# EAGLE design USB2MCV REV1 (EAGLE 6.1)

## Sheet 1 of 4
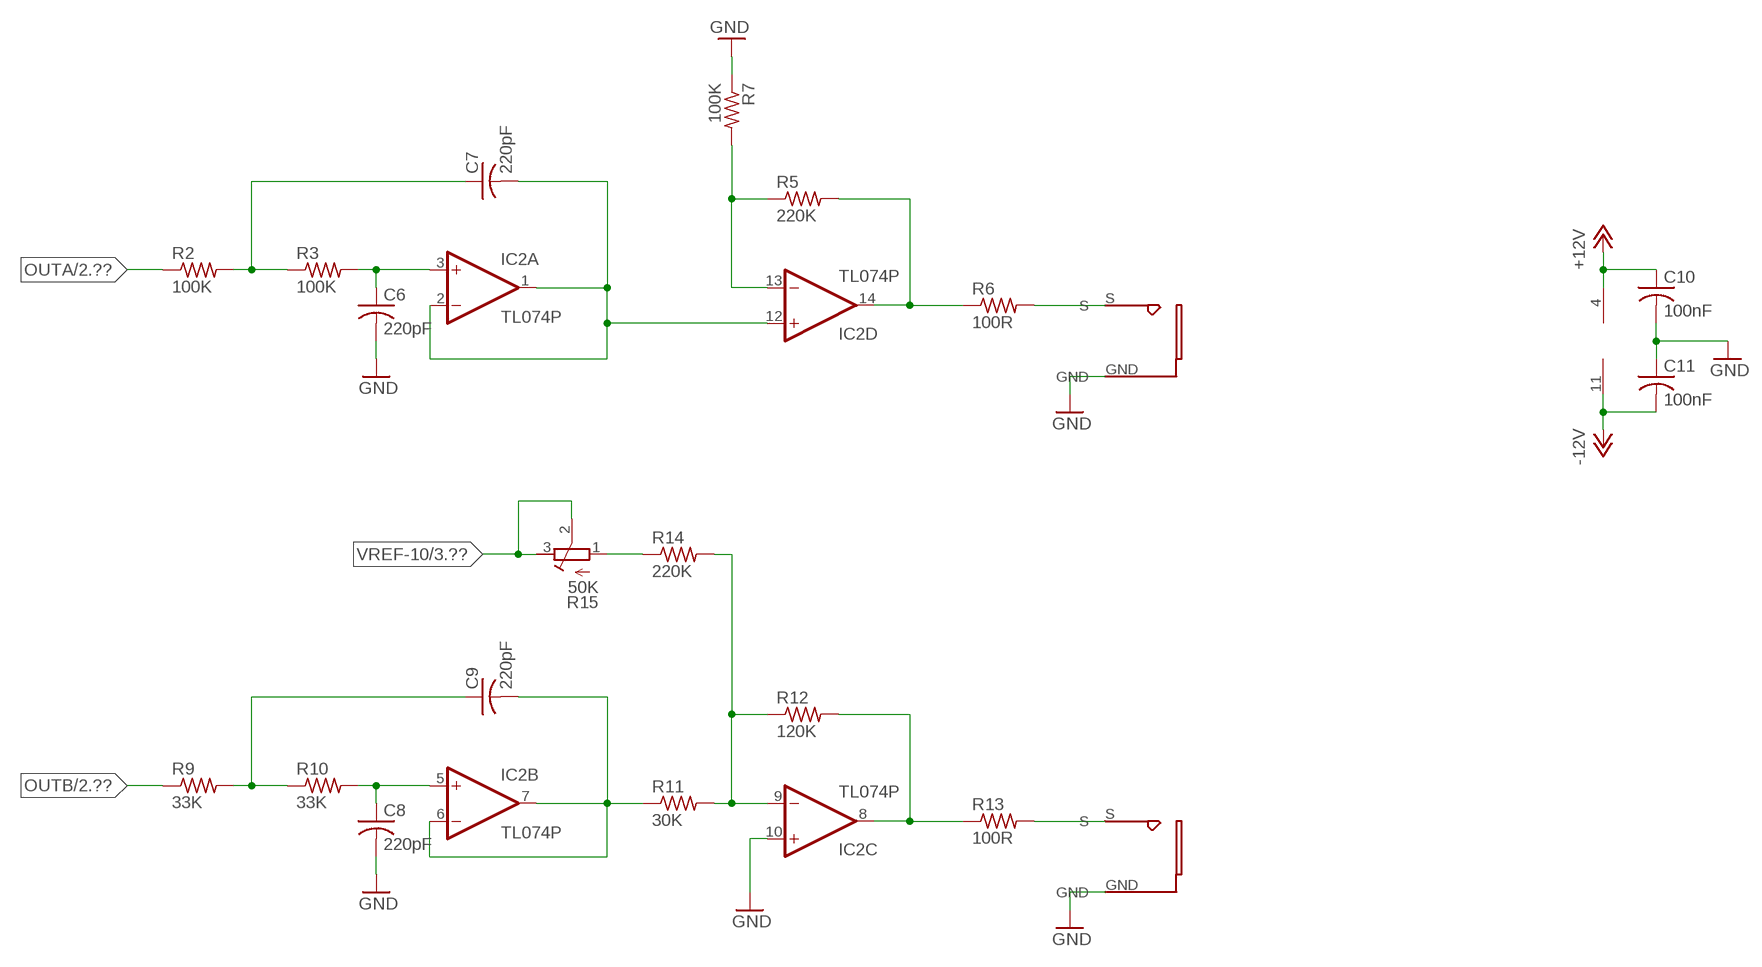
[diagram p0: schematic, sheet 1]

### Parts
C6  220pF  C-USC1206K  [C1206K]
C7  220pF  C-USC1206K  [C1206K]
C8  220pF  C-USC1206K  [C1206K]
C9  220pF  C-USC1206K  [C1206K]
C10  100nF  C-USC1206K  [C1206K]
C11  100nF  C-USC1206K  [C1206K]
IC2  TL074P  [DIL14]
OUT1  PJ302M  [PJ302M]
OUT2  PJ302M  [PJ302M]
R2  100K  R-US_R1206  [R1206]
R3  100K  R-US_R1206  [R1206]
R5  220K  R-US_R1206  [R1206]
R6  100R  R-US_R1206  [R1206]
R7  100K  R-US_R1206  [R1206]
R9  33K  R-US_R1206  [R1206]
R10  33K  R-US_R1206  [R1206]
R11  30K  R-US_R1206  [R1206]
R12  120K  R-US_R1206  [R1206]
R13  100R  R-US_R1206  [R1206]
R14  220K  R-US_R1206  [R1206]
R15  50K  R-TRIMM64Y  [RTRIM64Y]

### Nets
+12V: C10.1 IC2.4(P:V+) ; also sheet 2,3
-12V: C11.2 IC2.11(P:V-) ; also sheet 3
GND: C6.2 C8.2 C10.2 C11.1 IC2.10(C:+IN) OUT1.GND OUT2.GND R7.1 ; also sheet 2,3,4
N$10: C6.1 IC2.3(A:+IN) R3.2
N$11: C7.1 R2.2 R3.1
N$12: IC2.13(D:-IN) R5.1 R7.2
N$13: IC2.14(D:OUT) R5.2 R6.1
N$15: C9.2 IC2.6(B:-IN) IC2.7(B:OUT) R11.1
N$16: C8.1 IC2.5(B:+IN) R10.2
N$17: C9.1 R9.2 R10.1
N$18: IC2.9(C:-IN) R11.2 R12.1 R14.2
N$19: IC2.8(C:OUT) R12.2 R13.1
N$20: R14.1 R15.1(E)
N$31: C7.2 IC2.1(A:OUT) IC2.2(A:-IN) IC2.12(D:+IN)
OUT1: OUT1.S R6.2
OUT2: OUT2.S R13.2
OUTA: R2.1 ; also sheet 2
OUTB: R9.1 ; also sheet 2
VREF-10: R15.2(S) R15.3(A) ; also sheet 3

## Sheet 2 of 4
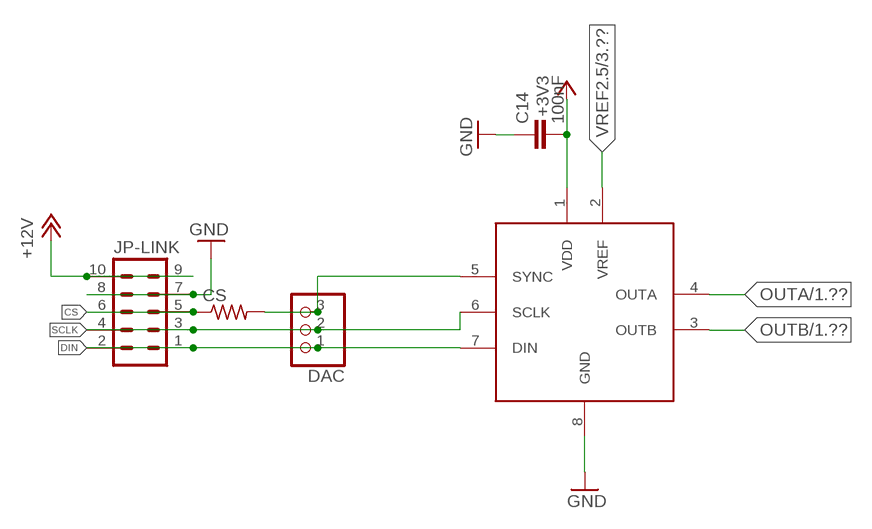
[diagram p1: schematic, sheet 2]

### Parts
C14  100nF  C-EUC1206K  [C1206K]
CS  R-US_R0402  [R0402]
DAC  PINHD-1X3_2.54  [1X03]
IC5  DAC8552  [MSOP-8]
JP-LINK  ML10  [ML10]

### Nets
+3V3: C14.2 IC5.1(VDD) ; also sheet 3
+12V: JP-LINK.9 JP-LINK.10 ; also sheet 1,3
CS: CS.1 JP-LINK.5 JP-LINK.6
DIN: DAC.1 IC5.7(DIN) JP-LINK.1 JP-LINK.2
GND: C14.1 IC5.8(GND) JP-LINK.7 JP-LINK.8 ; also sheet 1,3,4
OUTA: IC5.4(OUTA) ; also sheet 1
OUTB: IC5.3(OUTB) ; also sheet 1
SCLK: DAC.2 IC5.6(SCLK) JP-LINK.3 JP-LINK.4
SYNC: CS.2 DAC.3 IC5.5(SYNC)
VREF2.5: IC5.2(VREF) ; also sheet 3

## Sheet 3 of 4
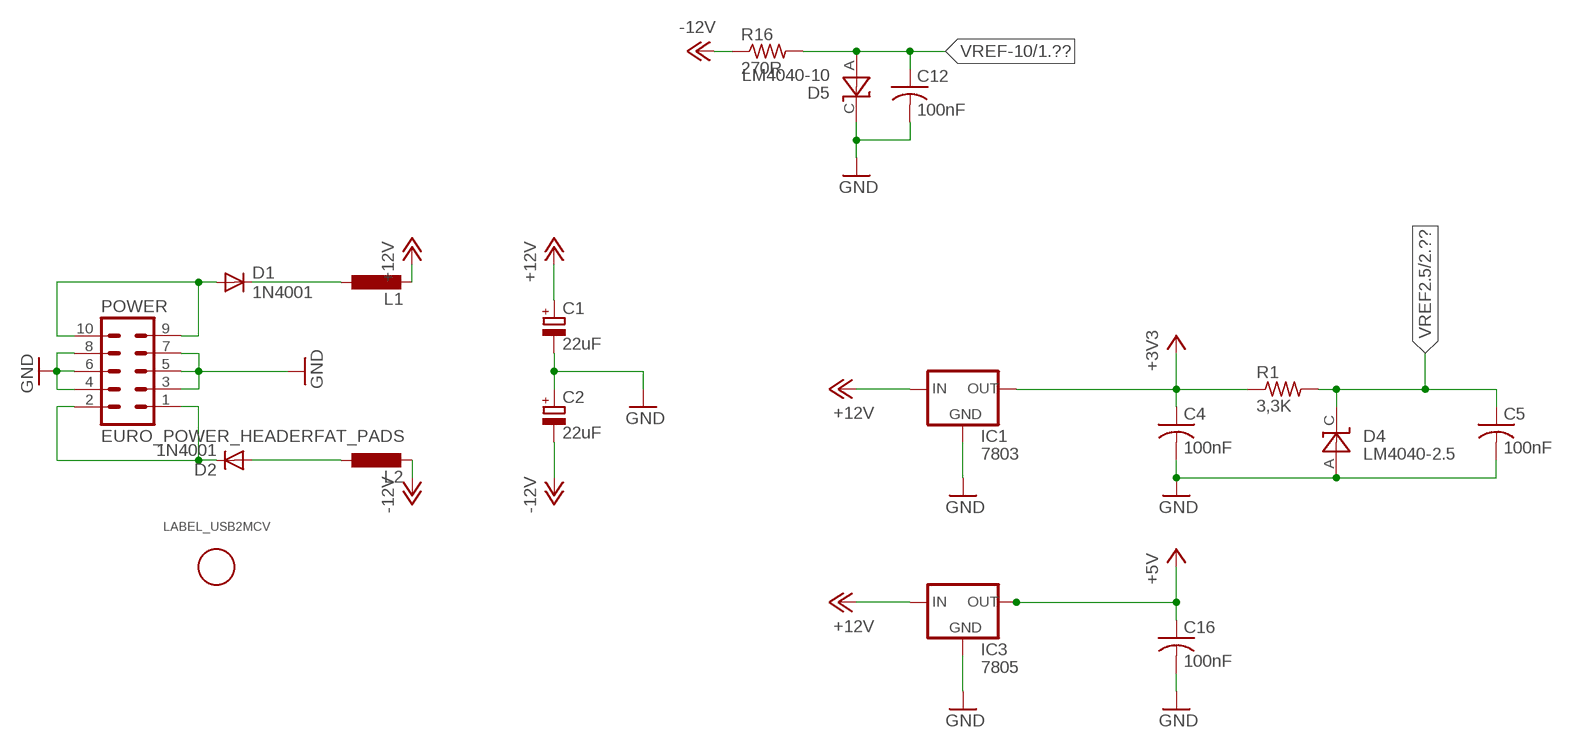
[diagram p2: schematic, sheet 3]

### Parts
C1  22uF  CPOL-EUE2-5  [E2-5]
C2  22uF  CPOL-EUE2-5  [E2-5]
C4  100nF  C-USC1206K  [C1206K]
C5  100nF  C-USC1206K  [C1206K]
C12  100nF  C-USC1206K  [C1206K]
C16  100nF  C-USC1206K  [C1206K]
D1  1N4001  1N4004  [DO41-10]
D2  1N4001  1N4004  [DO41-10]
D4  LM4040-2.5  LM4040DIP  [TO-92]
D5  LM4040-10  LM4040DIP  [TO-92]
IC1  7803  78LXX  [78LXX]
IC3  7805  78LXX  [78LXX]
L1  L-EU0207/10  [0207/10]
L2  L-EU0207/10  [0207/10]
POWER  EURO_POWER_HEADERFAT_PADS  [EURO_PWR_HEADER_FAT]
R1  3,3K  R-US_R1206  [R1206]
R16  270R  R-US_R1206  [R1206]
U$1  LABEL_USB2MCV  [LABEL_USB2DAC]

### Nets
+3V3: C4.1 IC1.OUT R1.1 ; also sheet 2
+5V: C16.1 IC3.OUT ; also sheet 4
+12V: C1.+ IC1.IN IC3.IN L1.2 ; also sheet 1,2
-12V: C2.- L2.2 R16.1 ; also sheet 1
GND: C1.- C2.+ C4.2 C5.2 C12.2 C16.2 D4.A D5.C IC1.GND IC3.GND POWER.3 POWER.4 POWER.5 POWER.6 POWER.7 POWER.8 ; also sheet 1,2,4
N$7: D2.C POWER.1 POWER.2
N$8: D1.A POWER.9 POWER.10
N$21: D2.A L2.1
N$22: D1.C L1.1
VREF2.5: C5.1 D4.C R1.2 ; also sheet 2
VREF-10: C12.1 D5.A R16.2 ; also sheet 1

## Sheet 4 of 4
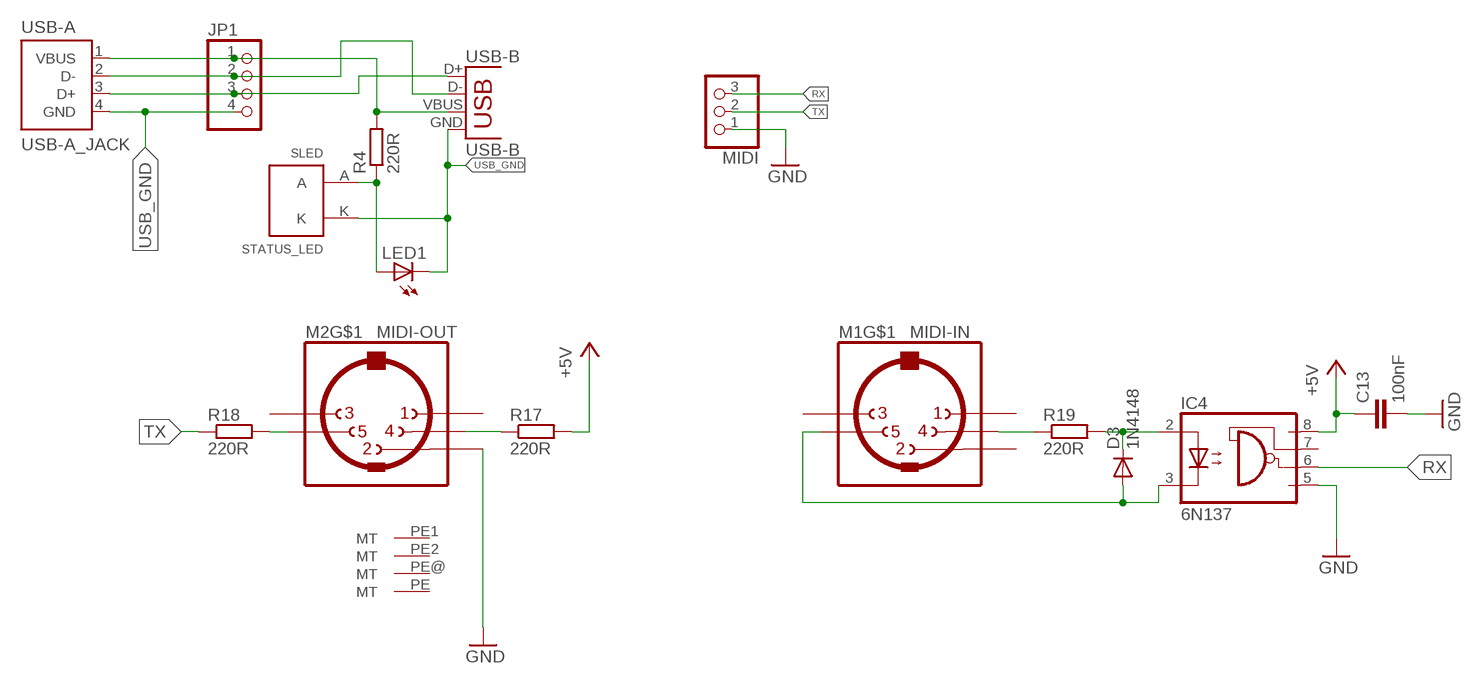
[diagram p3: schematic, sheet 4]

### Parts
C13  100nF  C-EUC1206K  [C1206K]
D3  1N4148  1N4148DO35-7  [DO35-7]
IC4  6N137  [DIL08]
JP1  PINHD-1X4_2.54  [1X04]
LED1  LED1206  [LED-1206]
M1  MIDI-IN  MIDIJACK  [CP-2350]
M2  MIDI-OUT  MIDIJACK  [CP-2350]
MIDI  PINHD-1X3_2.54  [1X03]
R4  220R  R-EU_R1206  [R1206@1]
R17  220R  R-EU_R1206  [R1206@1]
R18  220R  R-EU_R1206  [R1206@1]
R19  220R  R-EU_R1206  [R1206@1]
SLED  STATUS_LED  [STAUS-LED(DIP)]
USB-A  USB-A_JACK  [USB-A]
USB-B  USB-B  USBPTH  [USB-B-PTH]

### Nets
+5V: C13.1 IC4.8(VCC) R17.2 ; also sheet 3
D+: JP1.3 USB-A.3(D+) USB-B.D+
D-: JP1.2 USB-A.2(D-) USB-B.D-
GND: C13.2 IC4.5(GND) M2.2 MIDI.1 ; also sheet 1,2,3
N$1: LED1.A R4.1 SLED.A
N$5: D3.C IC4.2(A) R19.2
N$6: M2.5 R18.2
N$14: JP1.1 R4.2 USB-A.1(VBUS) USB-B.VBUS
N$27: M2.4 R17.1
N$28: M1.4 R19.1
N$30: D3.A IC4.3(C) M1.5
RX: IC4.6(VO) MIDI.3
TX: MIDI.2 R18.1
USB_GND: JP1.4 LED1.C SLED.K USB-A.4(GND) USB-B.GND
Unconnected: IC4.7(VE) M1.1 M1.2 M1.3 M1.PE1(MT) M1.PE2(MT) M1.PE(MT) M1.PE@(MT) M2.1 M2.3 M2.PE1(MT) M2.PE2(MT) M2.PE(MT) M2.PE@(MT)

## Library data of the parts
C1 C2 = resistor-mod:CPOL-EU: POLARIZED CAPACITOR, European symbol
C4-C12 C16 = resistor-mod:C-US: CAPACITOR, American symbol
C13 C14 = resistor-mod:C-EU: CAPACITOR, European symbol
CS R1-R3 R5-R7 R9-R14 R16 = resistor-mod:R-US_: RESISTOR, American symbol
D1 D2 = diode:1N4004: DIODE general purpose rectifier, 1 A
D3 = diode:1N4148: DIODE high speed (Philips)
D4 D5 = GuShH:LM4040
DAC MIDI = pinhead 2:PINHD-1X3: PIN HEADER
IC1 IC3 = v-reg mod:78LXX: VOLTAGE REGULATOR
IC2 = linear:TL074: OP AMP
IC4 = optocoupler:6N137: MOTOROLA OPTO COUPLER; MPN: 6N137; OC_FARNELL: 1328376; OC_NEWARK: 52M1895
IC5 = og-dac:DAC8552
JP1 = pinhead 2:PINHD-1X4: PIN HEADER
JP-LINK = con-ml:ML10: HARTING; OC_FARNELL: unknown; OC_NEWARK: unknown
L1 L2 = resistor-mod:L-EU: INDUCTOR, European symbol
LED1 = SparkFun-LED:LED: LEDs Standard schematic elements and footprints for 5mm, 3mm, 1206, and 0603 sized LEDs. 5mm - Spark Fun Electronics SKU : COM-00529 (and others)
M1 M2 = adafruit:MIDIJACK: DIN 5 jack also known as MIDI jack A modification of conn-hirshman:MAB5SH with two options for the grounding 'teeth'
OUT1 OUT2 = PJ203M 3.5mm:PJ302M: Klinkenbuchse 3.5mm Thonk
POWER = MusicThingModular mod:EURO_POWER_HEADER: Power Header 10 pin power header for Eurorack Power Supplies Variants with fatter pads for easier soldering, and the LOCK variant which has 5mil offset pins to hold the component in place before soldering
R4 R17-R19 = resistor-mod:R-EU_: RESISTOR, European symbol
R15 = resistor-mod:R-TRIMM: Trimm resistor
SLED = STATUS LED:STATUS_LED
U$1 = labels links:LABEL_USB2MCV
USB-A = USB:USB-A_JACK
USB-B = SparkFun-Connectors:USB: USB Connectors USB-B-PTH is fully proven SKU : PRT-00139/CONN-08278 USB-miniB is fully proven SKU : PRT-00587 USB-A-PCB is untested. USB-A-H is throughly reviewed, but untested. Spark Fun Electronics SKU : PRT-00437 USB-B-SMT is throughly reviewed, but untested. Needs silkscreen touching up. USB-A-S has not been used/tested USB-MB-H has not been used/tested USB-MICROB has been used. CONN-09505; PROD_ID: CONN-08278

## Board
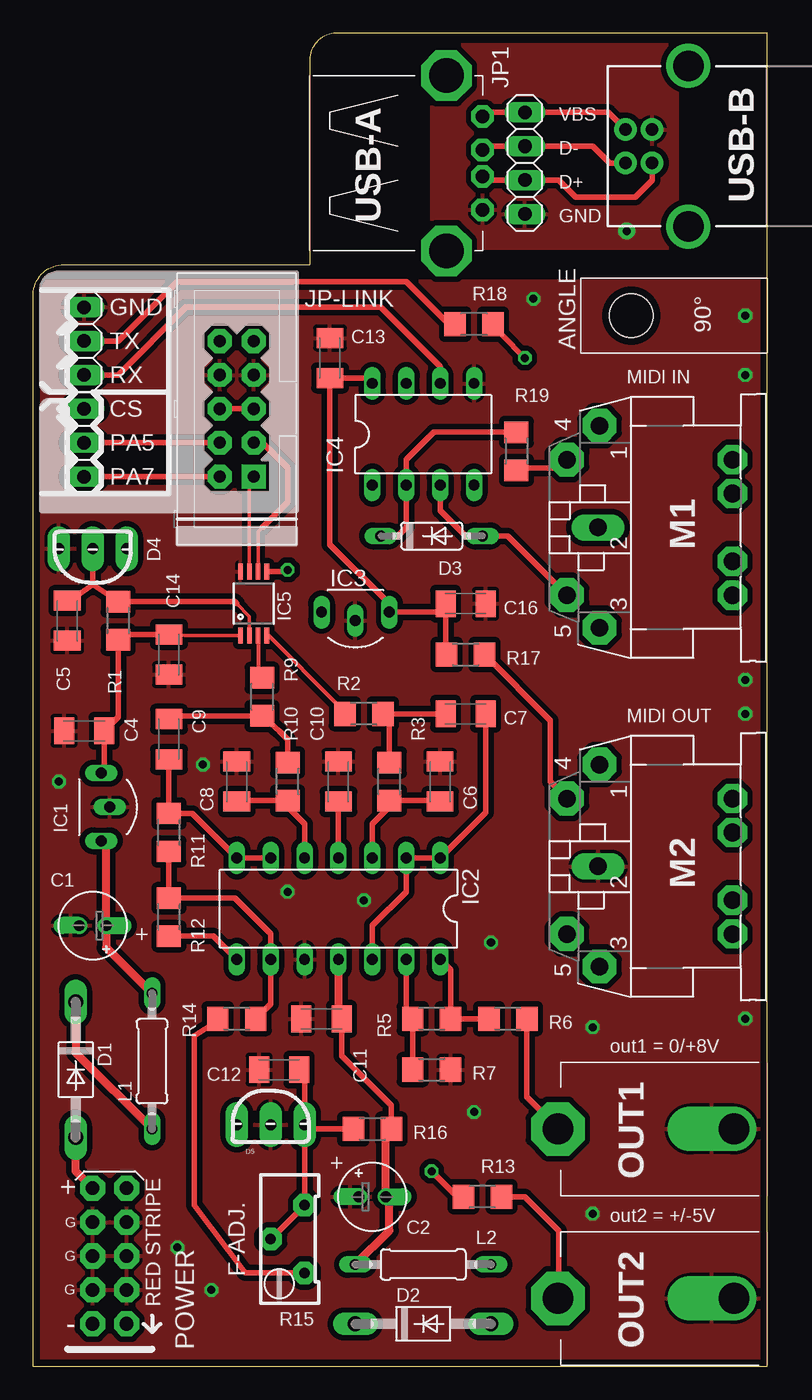
[diagram p4: board, top side]
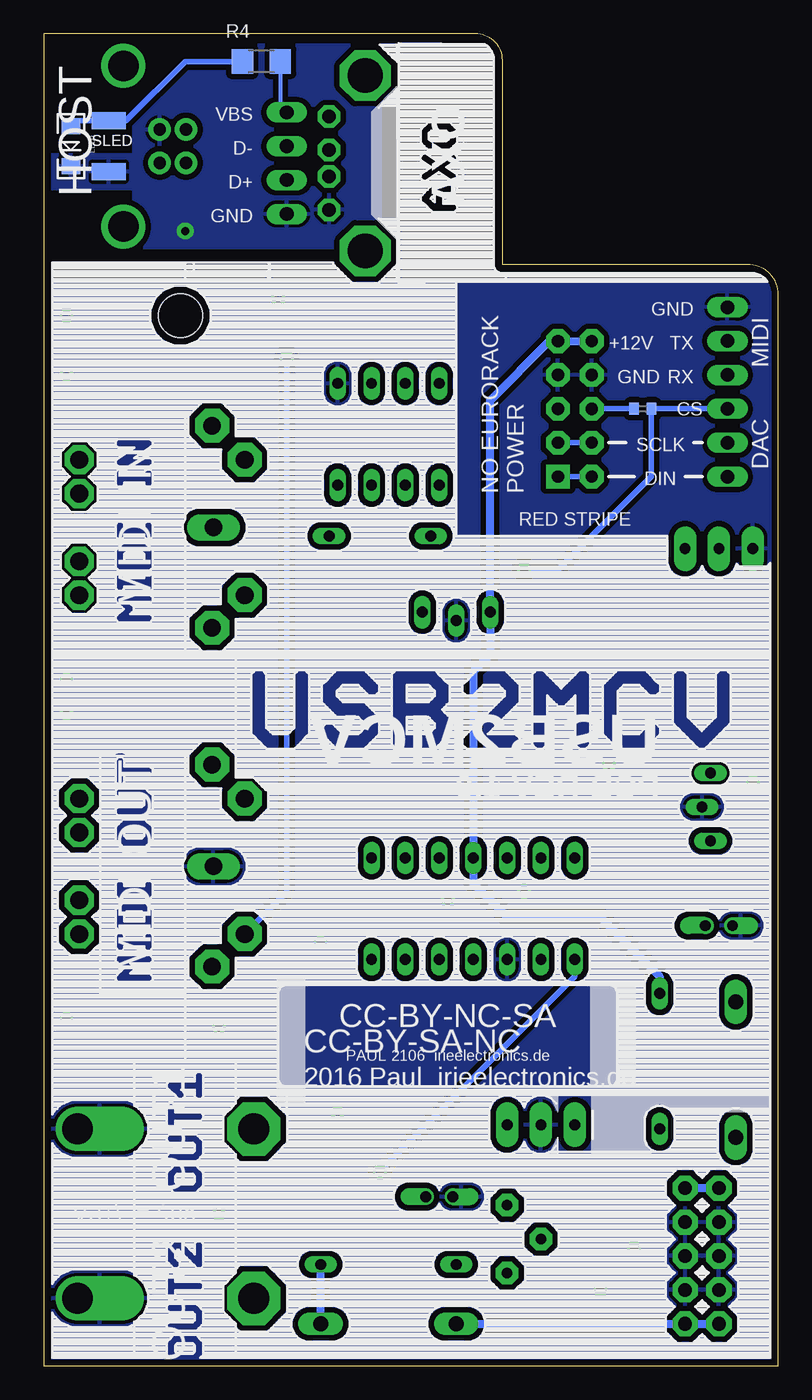
[diagram p5: board, bottom side, seen from below]

Size 55 x 99.9 mm. Coordinates in mm from the lower left corner, seen from the top.
Outline: 0,0 55,0 55,99.9 22.7,99.9 arc90 20.7,97.9 20.7,82.55 2.51,82.55 arc90 0,80.55 0,0
Copper layers (1*2*15*16): Top 0.035mm / dielectric 0.2mm / Route2 0.035mm / dielectric 1.2mm / Route15 0.035mm / dielectric 0.2mm / Bottom 0.035mm
Design rules: minimum track width 6mil, minimum drill 12mil, track to track 6mil, track to pad 8mil, pad to pad 12mil, via to via 6mil, smd to smd 0mil, copper to edge 20mil, drill to drill 10mil, minimum pad ring 6mil, minimum via ring 6mil, stop-mask expansion 0mil, vias tented up to drill 100mil, thermal gap 10mil

### Footprints (pad centres in the part's own frame; a part is rotated, then mirrored left to right if it is on the bottom)
E2-5 = drill 0.813 pad 1.27 offset: + -1.016,0; - 1.016,0
C1206K = smd 1.5 x 2: 1 -1.5,0; 2 1.5,0
R0402 = smd 0.7 x 0.9: 1 -0.65,0; 2 0.65,0
DO41-10 = drill 1.118 long: A 5.08,0; C -5.08,0
DO35-7 = drill 0.813 long: A 3.81,0; C -3.81,0
TO-92 = drill 0.813 pad 1.676 long: A 2.54,0.318; C 0,0.318; NC -2.54,0.318
1X03 = drill 1.016 long: 1 -2.54,0; 2 0,0; 3 2.54,0
78LXX = drill 0.813 long: GND 0,0.635; IN 2.54,0; OUT -2.54,0
DIL14 = drill 0.813 long: 1 -7.62,-3.81; 2 -5.08,-3.81; 3 -2.54,-3.81; 4 0,-3.81; 5 2.54,-3.81; 6 5.08,-3.81; 7 7.62,-3.81; 8 7.62,3.81; 9 5.08,3.81; 10 2.54,3.81; 11 0,3.81; 12 -2.54,3.81; 13 -5.08,3.81; 14 -7.62,3.81
DIL08 = drill 0.813 long: 1 -3.81,-3.81; 2 -1.27,-3.81; 3 1.27,-3.81; 4 3.81,-3.81; 5 3.81,3.81; 6 1.27,3.81; 7 -1.27,3.81; 8 -3.81,3.81
MSOP-8 = smd 0.345 x 1.2: 1 -0.975,-2.4; 2 -0.325,-2.4; 3 0.325,-2.4; 4 0.975,-2.4; 5 0.975,2.4; 6 0.325,2.4; 7 -0.325,2.4; 8 -0.975,2.4
1X04 = drill 1.016 long: 1 -3.81,0; 2 -1.27,0; 3 1.27,0; 4 3.81,0
ML10 = drill 0.914 pad 1.778 square: 1 -5.08,-1.27 | drill 0.914 pad 1.778 octagon: 2 -5.08,1.27; 3 -2.54,-1.27; 4 -2.54,1.27; 5 0,-1.27; 6 0,1.27; 7 2.54,-1.27; 8 2.54,1.27; 9 5.08,-1.27; 10 5.08,1.27
0207/10 = drill 0.813 long: 1 -5.08,0; 2 5.08,0
LED-1206 = smd 1.2 x 1.4: A -1.5,0; C 1.5,0
CP-2350 = drill 1.321 pad 2.54 octagon: 1 7.62,12.58; 3 -7.52,12.58; 4 5.08,15.02; 5 -5.08,15.02 | drill 1.321 long: 2 0,12.68 | drill 1.321 pad 2.184 octagon: PE -2.54,2.62; PE1 -5.08,2.62; PE2 5.08,2.62; PE@ 2.54,2.62
PJ302M = drill 2.3 pad 3.048 offset: GND 2.5,0 | drill 2.3 pad 4 octagon: S 15.7,0
EURO_PWR_HEADER_FAT = drill 1.016 pad 1.88 octagon: 1 -5.08,-1.27; 2 -5.08,1.27; 3 -2.54,-1.27; 4 -2.54,1.27; 5 0,-1.27; 6 0,1.27; 7 2.54,-1.27; 8 2.54,1.27; 9 5.08,-1.27; 10 5.08,1.27
R1206 = smd 1.6 x 1.803: 1 -1.422,0; 2 1.422,0
R1206@1 = smd 1.6 x 1.803: 1 -1.422,0; 2 1.422,0
RTRIM64Y = drill 0.8 pad 1.676 octagon: 1 0,-2.54; 2 -2.54,0; 3 0,2.54
STAUS-LED(DIP) = smd 2.54 x 1.27: A 0,1.905; K 0,-1.905
WINKEL90° = hole 3.3: 10.2,0
USB-A = drill 1 pad 1.676 octagon: 1 0,3.5; 2 0,1; 3 0,-1; 4 0,-3.5 | drill 2.6 pad 3.8 octagon: P$5 -2.71,6.57; P$6 -2.71,-6.57
USB-B-PTH = drill 0.914 pad 1.676: D+ 0,1.25; D- 1.981,1.25; GND 0,-1.25; VBUS 1.981,-1.25 | drill 2.286: S1 -2.718,-6.02; S2 -2.718,6.02

### Placement (x,y rotation side)
C1  4.45,33.02 180 top
C2  25.4,12.7 0 top
C4  3.81,47.62 180 top
C5  2.54,55.88 270 top
C6  30.48,43.81 90 top
C7  32.38,48.9 0 top
C8  15.24,43.81 90 top
C9  10.16,46.99 270 top
C10  22.86,43.81 90 top
C11  21.59,26.04 0 top
C12  18.41,22.23 180 top
C13  22.23,75.56 90 top
C14  10.16,53.34 90 top
C16  32.38,57.15 0 top
CS  10.16,71.75 0 bottom
D1  3.17,22.23 270 top
D2  29.21,3.17 0 top
D3  29.84,62.23 0 top
D4  4.45,61.59 180 top
D5  17.78,17.78 0 top
DAC  3.81,69.22 90 top
IC1  5.08,41.91 270 top
IC2  22.86,34.29 180 top
IC3  24.13,56.52 180 top
IC4  29.21,69.85 0 top
IC5  16.51,57.15 0 top
JP1  36.83,90.17 270 top
JP-LINK  15.24,71.75 90 top
L1  8.89,22.86 90 top
L2  29.21,7.62 180 top
LED1  53,91.44 270 bottom
M1  55,62.87 90 top
M2  55,37.47 90 top
MIDI  3.81,76.83 270 top
OUT1  55,17.78 180 top
OUT2  55,5.08 180 top
POWER  5.71,8.26 90 top
R1  6.35,55.88 90 top
R2  24.77,48.9 0 top
R3  26.67,43.81 270 top
R4  38.73,97.79 0 bottom
R5  29.84,26.04 0 top
R6  35.56,26.04 0 top
R7  29.84,22.23 180 top
R9  17.14,50.16 270 top
R10  19.05,43.81 270 top
R11  10.16,40.01 270 top
R12  10.16,33.66 270 top
R13  33.66,12.7 0 top
R14  15.24,26.04 0 top
R15  20.32,9.53 0 top
R16  25.4,17.78 180 top
R17  32.38,53.34 180 top
R18  33.02,78.11 0 top
R19  36.2,68.58 90 top
SLED  50.16,91.44 0 bottom
U$1  0,0 0 top
U$2  WINKEL  [WINKEL90°]  55,78.74 180 top
USB-A  33.66,90.17 0 top
USB-B  46.35,91.44 180 top

### Tracks (layer width: path | path; a pad name or v marks a point on that pad's centre or on a via)
+3V3
  Top 0.254: IC5.1 11.34,54.75 C14.2
  Top 0.406: C14.2 6.73,54.84 R1.1 6.35,48.66 C4.1 5.31,44.68 IC1.OUT
+5V
  Top 0.406: IC4.8 25,74.06 C13.1 22.23,61.59 26.67,57.15 IC3.OUT 30.48,56.52 30.48,57.15 C16.1 30.89,53.42 R17.2
+12V
  Top 0.406: C10.1 IC2.4
  Top 0.61: L1.2 5.46,31.37 C1.+ 5.46,38.99 IC1.IN
  Bottom 0.61: L1.2 8.89,29.21 13.34,33.66 20.32,33.66 22.86,36.2 IC2.4 22.86,52.07 21.59,53.34 IC3.IN 21.59,72.39 17.14,76.83 JP-LINK.9 JP-LINK.10
-12V
  Top 0.406: R16.1 26.82,19.53 23.09,23.27 C11.2
  Top 0.61: IC2.11 22.86,26.27 C11.2 | R16.1 26.42,17.37 C2.- 26.67,12.45 26.67,10.16 L2.2
CS
  Top 0.406: JP-LINK.6 JP-LINK.5
  Bottom 0.406: CS.1 JP-LINK.6
D+
  Top 0.406: USB-B.D+ 46.35,88.9 45.09,87.63 40.64,87.63 39.37,88.9 JP1.3 33.92,88.9 USB-A.3
D-
  Top 0.406: USB-B.D- 44.35,90.17 43.18,90.17 41.91,91.44 JP1.2 33.92,91.44 USB-A.2
DIN
  Top 0.254: IC5.7 16.18,66.35 JP-LINK.1
  Top 0.406: DAC.1 JP-LINK.2
  Bottom 0.406: JP-LINK.2 JP-LINK.1
GND  (via drill 0.6 pad 1.02)
  other vias: 34.29,31.75 53.34,26.04 53.34,48.9 53.34,51.44 53.34,74.3 53.34,78.74 37.47,80.01 24.77,34.92 19.05,35.56 12.7,45.09 13.34,5.71 33.02,19.05 41.91,25.4 41.91,11.43 10.79,8.89 1.91,43.81
  pour Top (isolate 0.406): 0,81.28 0,0 54.61,0 54.61,81.28
  pour Bottom (isolate 0.406): 0,81.28 0,0 54.61,0 54.61,81.28
N$1
  Bottom 0.406: R4.1 44.45,97.79 48.9,93.34 SLED.A 52.59,93.34 LED1.A
N$5
  Top 0.406: R19.2 30,70 27.94,67.94 IC4.2 27.94,62.87 27.3,62.23 D3.C
N$6  (via drill 0.6 pad 1.02)
  Top 0.406: R18.2 35.08,77.32 v36.83,75.56
  Bottom 0.406: v36.83,75.56 36.83,35.53 M2.5
N$7
  Bottom 0.61: POWER.2 POWER.1 D2.C
N$8
  Top 0.61: POWER.10 3.17,14.61 D1.A
  Bottom 0.61: POWER.10 POWER.9
N$10
  Top 0.406: C6.1 29.77,42.39 R3.2 26.67,41.91 25.4,40.64 IC2.3
N$11
  Top 0.406: C7.1 26.67,48.9 | 26.67,48.9 R3.1 | 26.67,48.9 R2.2
N$12
  Top 0.406: IC2.13 27.94,26.67 28.42,26.19 R5.1 R7.2
N$13
  Top 0.406: IC2.14 31.27,29.69 R5.2 R6.1
N$14
  Top 0.406: USB-B.VBUS 43.08,93.98 JP1.1 33.97,93.98 USB-A.1
  Bottom 0.305: R4.2 37.31,94.46 JP1.1
N$15
  Top 0.406: IC2.6 IC2.7 11.91,41.43 R11.1 C9.2
N$16
  Top 0.406: IC2.5 20.32,40.64 19.05,41.91 R10.2 15.32,42.39 C8.1
N$17
  Top 0.305: 10.41,48.74 C9.1
  Top 0.406: R10.1 19.05,46.99 18.41,47.62 R9.2 10.41,48.74
N$18
  Top 0.406: R11.2 R12.1 15.09,35.08 17.78,32.38 IC2.9 17.78,27.15 R14.2
N$19  (via drill 0.6 pad 1.02)
  Top 0.406: R12.2 13.49,32.23 IC2.8 | R13.1 31.75,12.7 v29.84,14.61
  Bottom 0.406: v29.84,14.61 15.24,29.21 IC2.8
N$20
  Top 0.406: R14.1 13.82,25.88 12.06,24.77 12.06,12.06 15.88,6.99 R15.1
N$21
  Bottom 0.61: D2.A L2.1
N$22
  Top 0.61: L1.1 3.17,23.5 D1.C
N$27
  Top 0.406: M2.4 39.98,42.57 38.73,43.81 38.73,48.41 R17.1
N$28
  Top 0.406: M1.4 39.98,67.92 39.37,67.31 36.35,67.31 R19.1
N$30
  Top 0.406: IC4.3 30.48,64.14 32.38,62.23 D3.A 35.53,62.23 M1.5
N$31
  Top 0.406: IC2.12 25.4,33.02 27.94,35.56 IC2.2 IC2.1 30.63,38.25 33.88,41.51 C7.2
OUT1
  Top 0.406: R6.2 36.98,20.17 39.37,17.78 OUT1.S
OUT2
  Top 0.406: R13.2 36.83,12.7 39.37,10.16 39.37,5.08 OUT2.S
OUTA
  Top 0.305: IC5.4 17.48,54.91 22.86,49.53 22.86,49.38 R2.1
OUTB
  Top 0.305: IC5.3 16.84,51.9 R9.1
RX
  Top 0.406: IC4.6 30.48,74.93 26.04,79.38 11.43,79.38 6.35,74.3 MIDI.3
SCLK
  Top 0.254: IC5.6 16.84,62.55 17.14,62.87
  Top 0.406: JP-LINK.3 17.14,69.22 19.05,67.31 19.05,64.77 17.14,62.87 | JP-LINK.4 DAC.2
  Bottom 0.406: JP-LINK.4 JP-LINK.3
SYNC  (via drill 0.6 pad 1.02)
  Top 0.406: IC5.5 18.91,59.55 v19.05,59.69
  Bottom 0.406: DAC.3 CS.2 | CS.2 9.53,71.75 | CS.2 9.51,66.69 16.51,59.69 v19.05,59.69
TX
  Top 0.406: R18.1 31.11,78.11 27.94,81.28 10.79,81.28 6.35,76.83 MIDI.2
USB_GND  (via drill 0.6 pad 1.27)
  other vias: 44.45,85.09
  pour Top (isolate 0.406): 29.84,99 29.84,83.82 48.26,83.82 48.26,99
  pour Bottom (isolate 0.406): 29.84,99 29.84,83.82 48.26,83.82 48.26,88.27 54.61,88.27 54.61,90.81 48.26,90.81 48.26,99
VREF2.5
  Top 0.254: IC5.2 16.18,56.2 15.24,57.15
  Top 0.406: 15.24,57.15 15.09,57.3 R1.2 4.45,58.57 | 4.45,58.57 2.69,57.3 2.54,57.15 C5.1 | D4.C 4.45,58.57
VREF-10
  Top 0.406: R15.2 R15.3 D5.A | R16.2 20.64,17.78 D5.A | D5.A 20.32,21.82 C12.1

### Text on the board
tPlace: VBS | D- | D+ | GND | GND | TX | RX | MIDI IN | CS | PA5 | PA7 | MIDI OUT | + | out1 = 0/+8V | + | out2 = +/-5V
bPlace: VBS | D- | SLED | D+ | GND | GND | TX | +12V | RX | GND | SCLK | DIN | POWER | NO EURORACK | RED STRIPE | CC-BY-NC-SA | PAUL 2106 irieelectronics.de | ou2 = -/+5V
tNames: 90° | ANGLE | F-ADJ.
bNames: AXO | HOST | MIDI IN | USB2MCV | PCB REV 1.0 | MIDI OUT | CC-BY-SA-NC | 2016 Paul irieelectronics.de | OUT1 | OUT2